# Altium project tpms-node.prjpcb
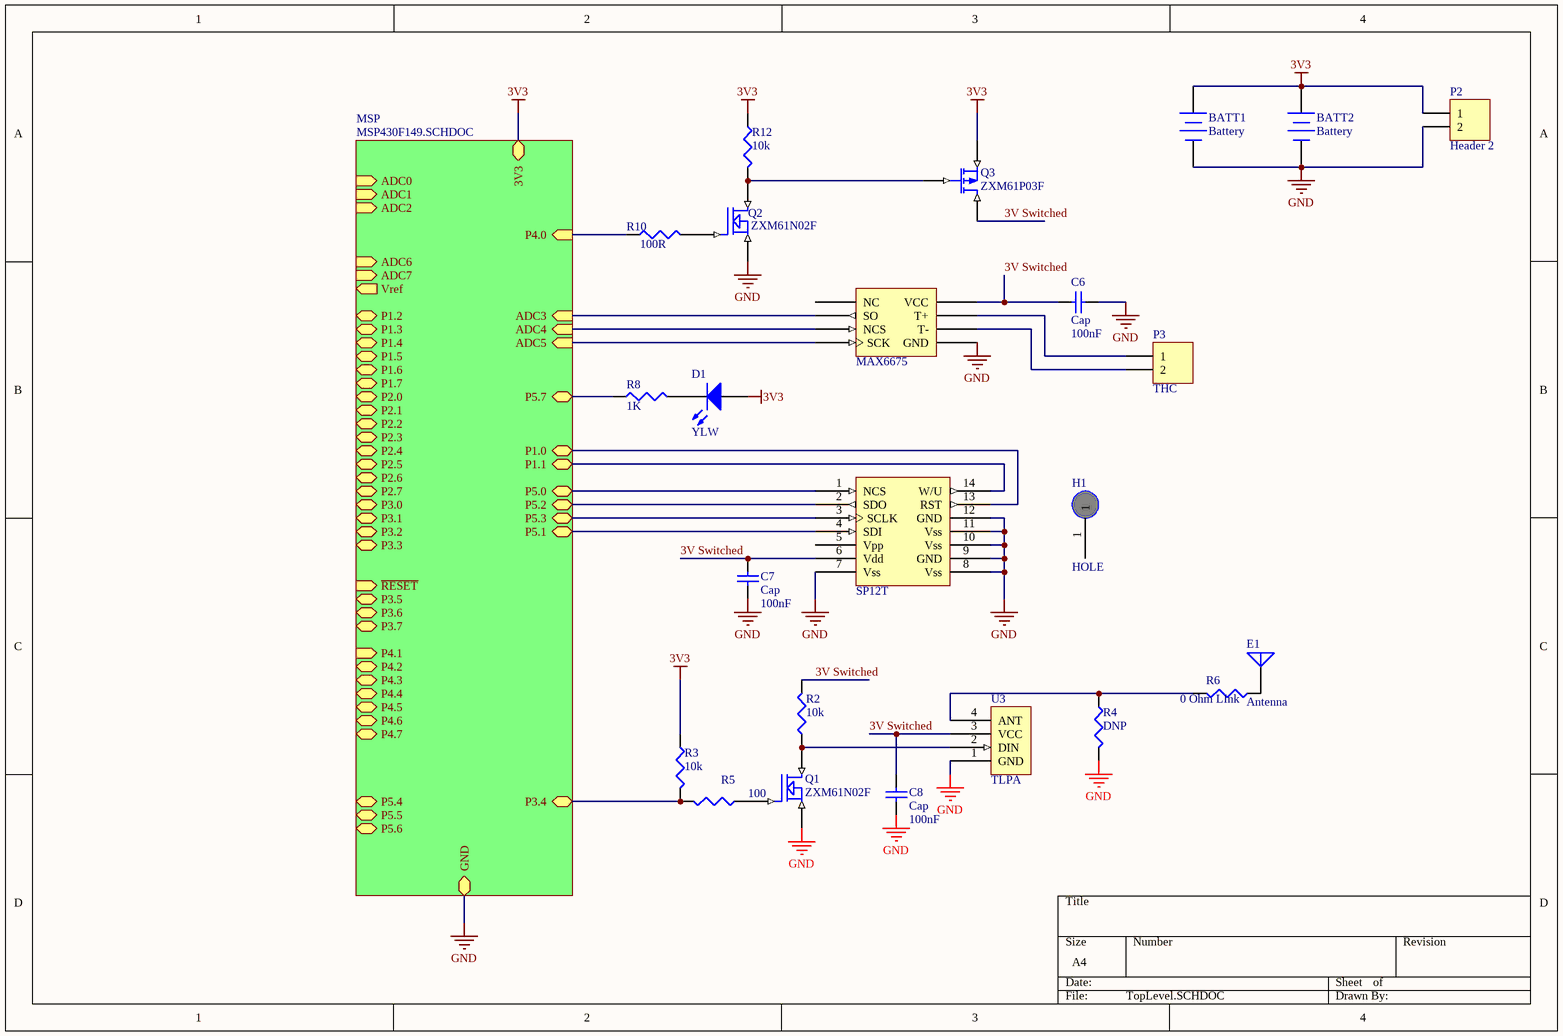
[diagram p0: TopLevel.SCHDOC]
2 sheets, 35 parts. Net scope: hierarchical (ports join the sheet entries above them; power ports are global).
Board files: tpms-node.pcbdoc, blank.PcbDoc
Sheets:
  TopLevel.SCHDOC
    MSP = MSP430F149.SCHDOC

## Sheet TopLevel.SCHDOC
size A4

### Parts
BATT1  Battery  [Keystone CR1632 Holder]
BATT2  Battery  [Keystone CR1632 Holder]
C6  Cap  value 100nF  [1608[0603]]
C7  Cap  value 100nF  [1608[0603]]
C8  Cap  value 100nF  [1608[0603]]
D1  YLW  [2012[0805]]
E1  Antenna  [PIN1]
H1  HOLE  [M2.5]
MAX6675  MAX6675  [SO8]  (value not drawn)
P2  Header 2  [HDR1X2]
P3  THC  [HDR1X2]
Q1  ZXM61N02F  [SOT23]
Q2  ZXM61N02F  [SOT23-3]
Q3  ZXM61P03F  [SOT23-3]
R2  10k  [1608[0603]]
R3  10k  [1608[0603]]
R4  DNP  [1608[0603]]
R5  100  [1608[0603]]
R6  0 Ohm LInk  [1608[0603]]
R8  1K  [1608[0603]]
R10  100R  [1608[0603]]
R12  10k  [1608[0603]]
SP12T  SP12T  [SOP14]  (value not drawn)
U3  TLPA  [TLPA Flat]

### Sub-sheets
MSP = MSP430F149.SCHDOC: GND, 3V3, ADC0 (in), ADC1 (in), ADC2 (in), ADC3 (in), ADC4 (in), ADC5 (in), ADC6 (in), ADC7 (in), P1.0, P1.1, P1.2, P1.3, P1.4, P1.5, P1.6, P1.7, P2.0, P2.1, P2.2, P2.3, P2.4, P2.5, P2.6, P2.7, P3.0, P3.1, P3.2, P3.3, P3.4, Vref (out), ~{RESET} (in), P3.5, P3.6, P3.7, P4.0 (in), P4.1 (in), P4.2, P4.3, P4.4, P4.5, P4.6, P4.7, P5.0, P5.1, P5.2, P5.3, P5.4, P5.5, P5.6, P5.7

### Nets
3V3: BATT1.1(+) BATT2.1(+) D1.1(A) P2.1 Q3.2(D) R3.1 R12.1 ; sheet MSP/3V3  [project net 3V]
GND: BATT1.2(-) BATT2.2(-) C6.2 C7.1 C8.1 MAX6675.1(GND) P2.2 Q1.2(S) Q2.2(S) R4.2 SP12T.7(Vss) SP12T.8(Vss) SP12T.9(GND) SP12T.10(Vss) SP12T.11(Vss) SP12T.12(GND) U3.1(GND) ; sheet MSP/GND
3V Switched: C6.1 C7.2 C8.2 MAX6675.4(VCC) Q3.3(S) R2.2 SP12T.6(Vdd) U3.3(VCC)
ADC3: MAX6675.7(SO) ; sheet MSP/ADC3
ADC4: MAX6675.6(NCS) ; sheet MSP/ADC4
ADC5: MAX6675.5(SCK) ; sheet MSP/ADC5
P1.0: SP12T.13(RST) ; sheet MSP/P1.0
P1.1: SP12T.14(W/U) ; sheet MSP/P1.1
P3.4: R3.2 R5.2 ; sheet MSP/P3.4
P4.0: R10.1 ; sheet MSP/P4.0
P5.0: SP12T.1(NCS) ; sheet MSP/P5.0
P5.1: SP12T.4(SDI) ; sheet MSP/P5.1
P5.2: SP12T.2(SDO) ; sheet MSP/P5.2
P5.3: SP12T.3(SCLK) ; sheet MSP/P5.3
P5.7: R8.1 ; sheet MSP/P5.7
NetD1_2: D1.2(K) R8.2
NetE1_1: E1.1(A) R6.1
NetMAX6675_2: MAX6675.2(T-) P3.2
NetMAX6675_3: MAX6675.3(T+) P3.1
NetQ1_1: Q1.1(G) R5.1
NetQ1_3: Q1.3(D) R2.1 U3.2(DIN)
NetQ2_1: Q2.1(G) R10.2
NetQ2_3: Q2.3(D) Q3.1(G) R12.2
NetR4_1: R4.1 R6.2 U3.4(ANT)

Not connected (* = marked no-connect by the designer): H1 1; MAX6675 8(NC); SP12T 5(Vpp)

### Library data of the parts
BATT1 BATT2 = Battery: Multicell Battery; pin to pad: 1>0; Published: 24-Mar-1999; LatestRevisionDate: 17-Jul-2002; LatestRevisionNote: Re-released for DXP Platform.; PackageReference: BAT-2; Publisher: Altium Limited
C6-C8 = Cap: Capacitor; Published: 8-Jun-2000; LatestRevisionDate: 17-Jul-2002; LatestRevisionNote: Re-released for DXP Platform.; PackageReference: RAD-0.3; Publisher: Altium Limited
D1 = LED1: Typical RED GaAs LED; Published: 8-Jun-2000; LatestRevisionDate: 08-Jul-2005; LatestRevisionNote: Mech Layer 1 removed.; PackageReference: LED-1; Publisher: Altium Limited
E1 = Antenna: Generic Antenna; Published: 24-Mar-1999; Revision: July-2002: Re-released for DXP Platform.; Publisher: Altium Limited
MAX6675 = MAX6675: MAXIM 6675 SPI Thermocouple Amplifier
P2 P3 = Header 2: Header, 2-Pin; LatestRevisionDate: 17-Jul-2002; LatestRevisionNote: Re-released for DXP Platform.; Publisher: Altium Limited
Q1 Q2 = ZXM61N02F: 1.7A, 20V N-Channel Enhancement mode FET
  Q2: Farnell: 3256182; Price: 0.78
Q3 = ZXM61P03F: 1.1A, 30V P-Channel Enhancement mode FET; Farnell: 3256212; Price: 0.82
R2-R6 R8 R10 R12 = RES1: Resistor; Farnell: *
  R10 R12: Price: *
SP12T = SP12T: Pressure/Temperature sensor

## Sheet MSP430F149.SCHDOC
size A4; Organization: UNSW Solar Racing Team; Address3: UNSW; Address4: Sydney NSW 2052; Address2: Electrical Engineering; Address1: Rm 109
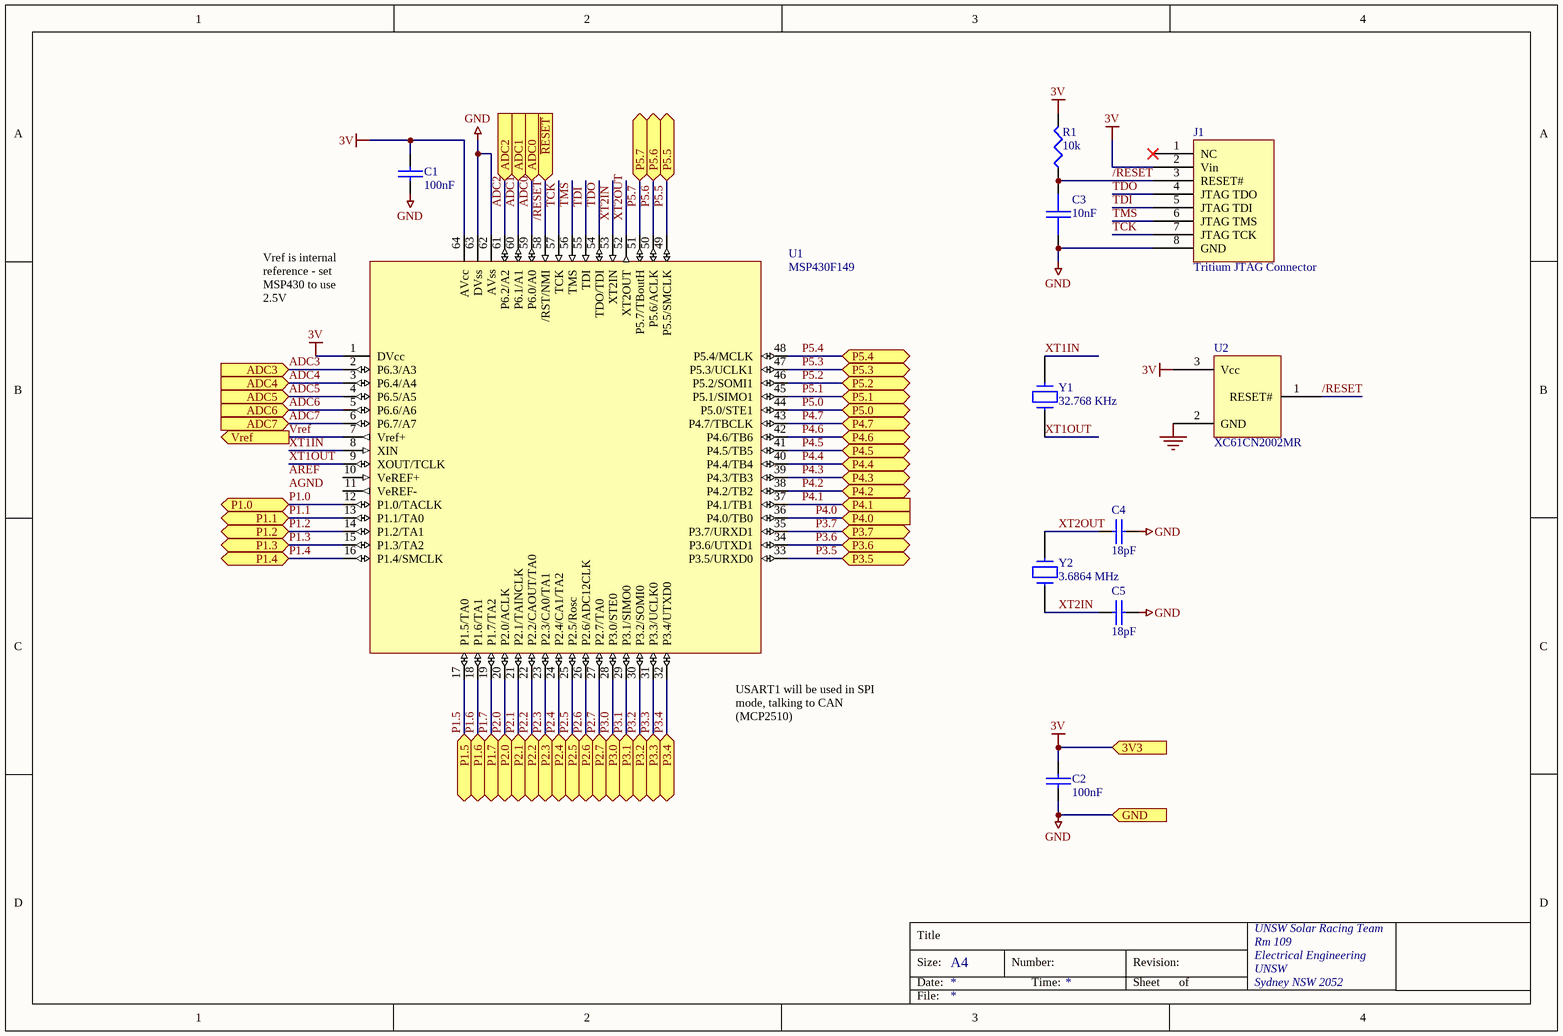
[diagram p1: MSP430F149.SCHDOC]

### Parts
C1  100nF  [1608[0603]]
C2  100nF  [1608[0603]]
C3  10nF  [1608[0603]]
C4  18pF  [1608[0603]]
C5  18pF  [1608[0603]]
J1  Tritium JTAG Connector  [IDC8]
R1  10k  [1608[0603]]
U1  MSP430F149  [QFP64]
U2  XC61CN2002MR  [SOT23]
Y1  32.768 KHz  [WATCHA]
Y2  3.6864 MHz  [HC49/4H]

### Ports
3V3, ADC0 (in), ADC1 (in), ADC2 (in), ADC3 (in), ADC4 (in), ADC5 (in), ADC6 (in), ADC7 (in), GND, P1.0, P1.1, P1.2, P1.3, P1.4, P1.5, P1.6, P1.7, P2.0, P2.1, P2.2, P2.3, P2.4, P2.5, P2.6, P2.7, P3.0, P3.1, P3.2, P3.3, P3.4, P3.5, P3.6, P3.7, P4.0 (in), P4.1 (in), P4.2, P4.3, P4.4, P4.5, P4.6, P4.7, P5.0, P5.1, P5.2, P5.3, P5.4, P5.5, P5.6, P5.7, Vref (out), ~{RESET} (in)

### Nets
3V: C1.1 C2.1 J1.2(Vin) R1.2 U1.1(DVcc) U1.64(AVcc) U2.3(Vcc) ; port 3V3
GND: C1.2 C2.2 C3.2 C4.2 C5.2 J1.8(GND) U1.62(AVss) U1.63(DVss) U2.2(GND) ; port GND
/RESET: C3.1 J1.3(RESET#) R1.1 U1.58(/RST/NMI) U2.1(RESET#) ; port ~{RESET}
ADC0: U1.59(P6.0/A0) ; port ADC0
ADC1: U1.60(P6.1/A1) ; port ADC1
ADC2: U1.61(P6.2/A2) ; port ADC2
ADC3: U1.2(P6.3/A3) ; port ADC3
ADC4: U1.3(P6.4/A4) ; port ADC4
ADC5: U1.4(P6.5/A5) ; port ADC5
ADC6: U1.5(P6.6/A6) ; port ADC6
ADC7: U1.6(P6.7/A7) ; port ADC7
P1.0: U1.12(P1.0/TACLK) ; port P1.0
P1.1: U1.13(P1.1/TA0) ; port P1.1
P1.2: U1.14(P1.2/TA1) ; port P1.2
P1.3: U1.15(P1.3/TA2) ; port P1.3
P1.4: U1.16(P1.4/SMCLK) ; port P1.4
P1.5: U1.17(P1.5/TA0) ; port P1.5
P1.6: U1.18(P1.6/TA1) ; port P1.6
P1.7: U1.19(P1.7/TA2) ; port P1.7
P2.0: U1.20(P2.0/ACLK) ; port P2.0
P2.1: U1.21(P2.1/TAINCLK) ; port P2.1
P2.2: U1.22(P2.2/CAOUT/TA0) ; port P2.2
P2.3: U1.23(P2.3/CA0/TA1) ; port P2.3
P2.4: U1.24(P2.4/CA1/TA2) ; port P2.4
P2.5: U1.25(P2.5/Rosc) ; port P2.5
P2.6: U1.26(P2.6/ADC12CLK) ; port P2.6
P2.7: U1.27(P2.7/TA0) ; port P2.7
P3.0: U1.28(P3.0/STE0) ; port P3.0
P3.1: U1.29(P3.1/SIMO0) ; port P3.1
P3.2: U1.30(P3.2/SOMI0) ; port P3.2
P3.3: U1.31(P3.3/UCLK0) ; port P3.3
P3.4: U1.32(P3.4/UTXD0) ; port P3.4
P3.5: U1.33(P3.5/URXD0) ; port P3.5
P3.6: U1.34(P3.6/UTXD1) ; port P3.6
P3.7: U1.35(P3.7/URXD1) ; port P3.7
P4.0: U1.36(P4.0/TB0) ; port P4.0
P4.1: U1.37(P4.1/TB1) ; port P4.1
P4.2: U1.38(P4.2/TB2) ; port P4.2
P4.3: U1.39(P4.3/TB3) ; port P4.3
P4.4: U1.40(P4.4/TB4) ; port P4.4
P4.5: U1.41(P4.5/TB5) ; port P4.5
P4.6: U1.42(P4.6/TB6) ; port P4.6
P4.7: U1.43(P4.7/TBCLK) ; port P4.7
P5.0: U1.44(P5.0/STE1) ; port P5.0
P5.1: U1.45(P5.1/SIMO1) ; port P5.1
P5.2: U1.46(P5.2/SOMI1) ; port P5.2
P5.3: U1.47(P5.3/UCLK1) ; port P5.3
P5.4: U1.48(P5.4/MCLK) ; port P5.4
P5.5: U1.49(P5.5/SMCLK) ; port P5.5
P5.6: U1.50(P5.6/ACLK) ; port P5.6
P5.7: U1.51(P5.7/TBoutH) ; port P5.7
TCK: J1.7(JTAG_TCK) U1.57(TCK)
TDI: J1.5(JTAG_TDI) U1.55(TDI)
TDO: J1.4(JTAG_TDO) U1.54(TDO/TDI)
TMS: J1.6(JTAG_TMS) U1.56(TMS)
Vref: U1.7(Vref+) ; port Vref
XT1IN: U1.8(XIN) Y1.2
XT1OUT: U1.9(XOUT/TCLK) Y1.1
XT2IN: C5.1 U1.53(XT2IN) Y2.1
XT2OUT: C4.1 U1.52(XT2OUT) Y2.2

Not connected (* = marked no-connect by the designer): J1 1(NC)*; U1 10(VeREF+) 11(VeREF-)

### Notes on the sheet
- (near U1) Vref is internal reference - set MSP430 to use 2.5V
- (near U1) USART1 will be used in SPI mode, talking to CAN (MCP2510)
- Labels drawn without touching a wire or pin: AGND, AREF
- Title
- Size:
- Date:
- A4
- Number:
- Time:
- Revision:
- Sheet
- of
- File:

### Library data of the parts
C1-C5 = CAP: Capacitor
  C1 C2: Farnell: 753-567; Price: 0.31
  C3: Farnell: 722-236; Price: 0.15
  C4 C5: Farnell: 721-992; Price: 0.11
J1 = 430F_JTAG_TRITIUM: Tritium JTAG interface for MSP430; Farnell: 511-808; Price: 1.32
R1 = RES1: Resistor; Farnell: 612-601; Price: 0.11
U1 = MSP430F14X: Farnell: NA
U2 = XC61F: SOT23 reset generator; Farnell: NA
Y1 Y2 = CRYSTAL
  Y1: Farnell: 103-868
  Y2: Farnell: 485-111; Price: 3.38

## Nets that join several sheets
3V: TopLevel (7 pins), MSP430F149 (7 pins)
GND: TopLevel (17 pins), MSP430F149 (9 pins)
ADC3: TopLevel (MAX6675.7), MSP430F149 (U1.2)
ADC4: TopLevel (MAX6675.6), MSP430F149 (U1.3)
ADC5: TopLevel (MAX6675.5), MSP430F149 (U1.4)
P1.0: TopLevel (SP12T.13), MSP430F149 (U1.12)
P1.1: TopLevel (SP12T.14), MSP430F149 (U1.13)
P3.4: TopLevel (R3.2 R5.2), MSP430F149 (U1.32)
P4.0: TopLevel (R10.1), MSP430F149 (U1.36)
P5.0: TopLevel (SP12T.1), MSP430F149 (U1.44)
P5.1: TopLevel (SP12T.4), MSP430F149 (U1.45)
P5.2: TopLevel (SP12T.2), MSP430F149 (U1.46)
P5.3: TopLevel (SP12T.3), MSP430F149 (U1.47)
P5.7: TopLevel (R8.1), MSP430F149 (U1.51)